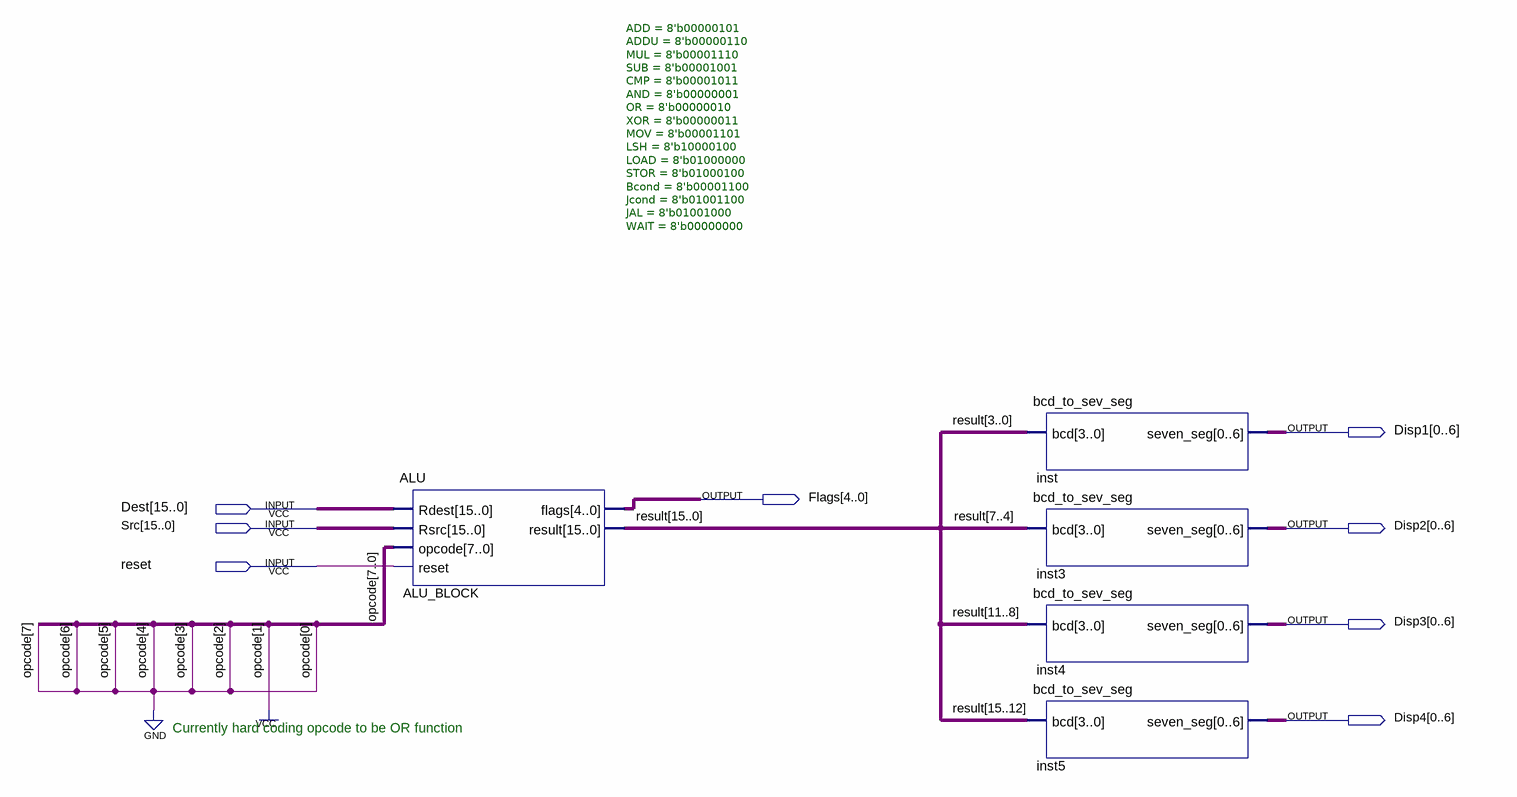
[diagram p0: schematic sheet]
// Quartus schematic ALU_BLOCK_Test.bdf as structural Verilog: 5 symbols, 8 pins
module ALU_BLOCK_Test (
  input  [15:0] Dest,
  input  [15:0] Src,
  input  reset,
  output [0:6] Disp1,
  output [4:0] Flags,
  output [0:6] Disp2,
  output [0:6] Disp3,
  output [0:6] Disp4
);

  wire [15:0] result;

  ALU #(.ADD(8'b00000101), .ADDU(8'b00000110), .MUL(8'b00001110), .SUB(8'b00001001), .CMP(8'b00001011), .AND(8'b00000001), .OR(8'b00000010), .XOR(8'b00000011), .MOV(8'b00001101), .LSH(8'b10000100), .LOAD(8'b01000000), .STOR(8'b01000100), .Bcond(8'b00001100), .Jcond(8'b01001100), .JAL(8'b01001000), .WAIT(8'b00000000)) ALU_BLOCK (
    .Rdest(Dest), .Rsrc(Src), .opcode(8'b00000010), .reset(reset), .flags(Flags), .result(result));
  bcd_to_sev_seg inst (.bcd(result[3:0]), .seven_seg(Disp1));
  bcd_to_sev_seg inst3 (.bcd(result[7:4]), .seven_seg(Disp2));
  bcd_to_sev_seg inst4 (.bcd(result[11:8]), .seven_seg(Disp3));
  bcd_to_sev_seg inst5 (.bcd(result[15:12]), .seven_seg(Disp4));

  // Notes on the sheet:
  //   Currently hard coding opcode to be OR function
endmodule
